# EAGLE design node (EAGLE 7.2.0)
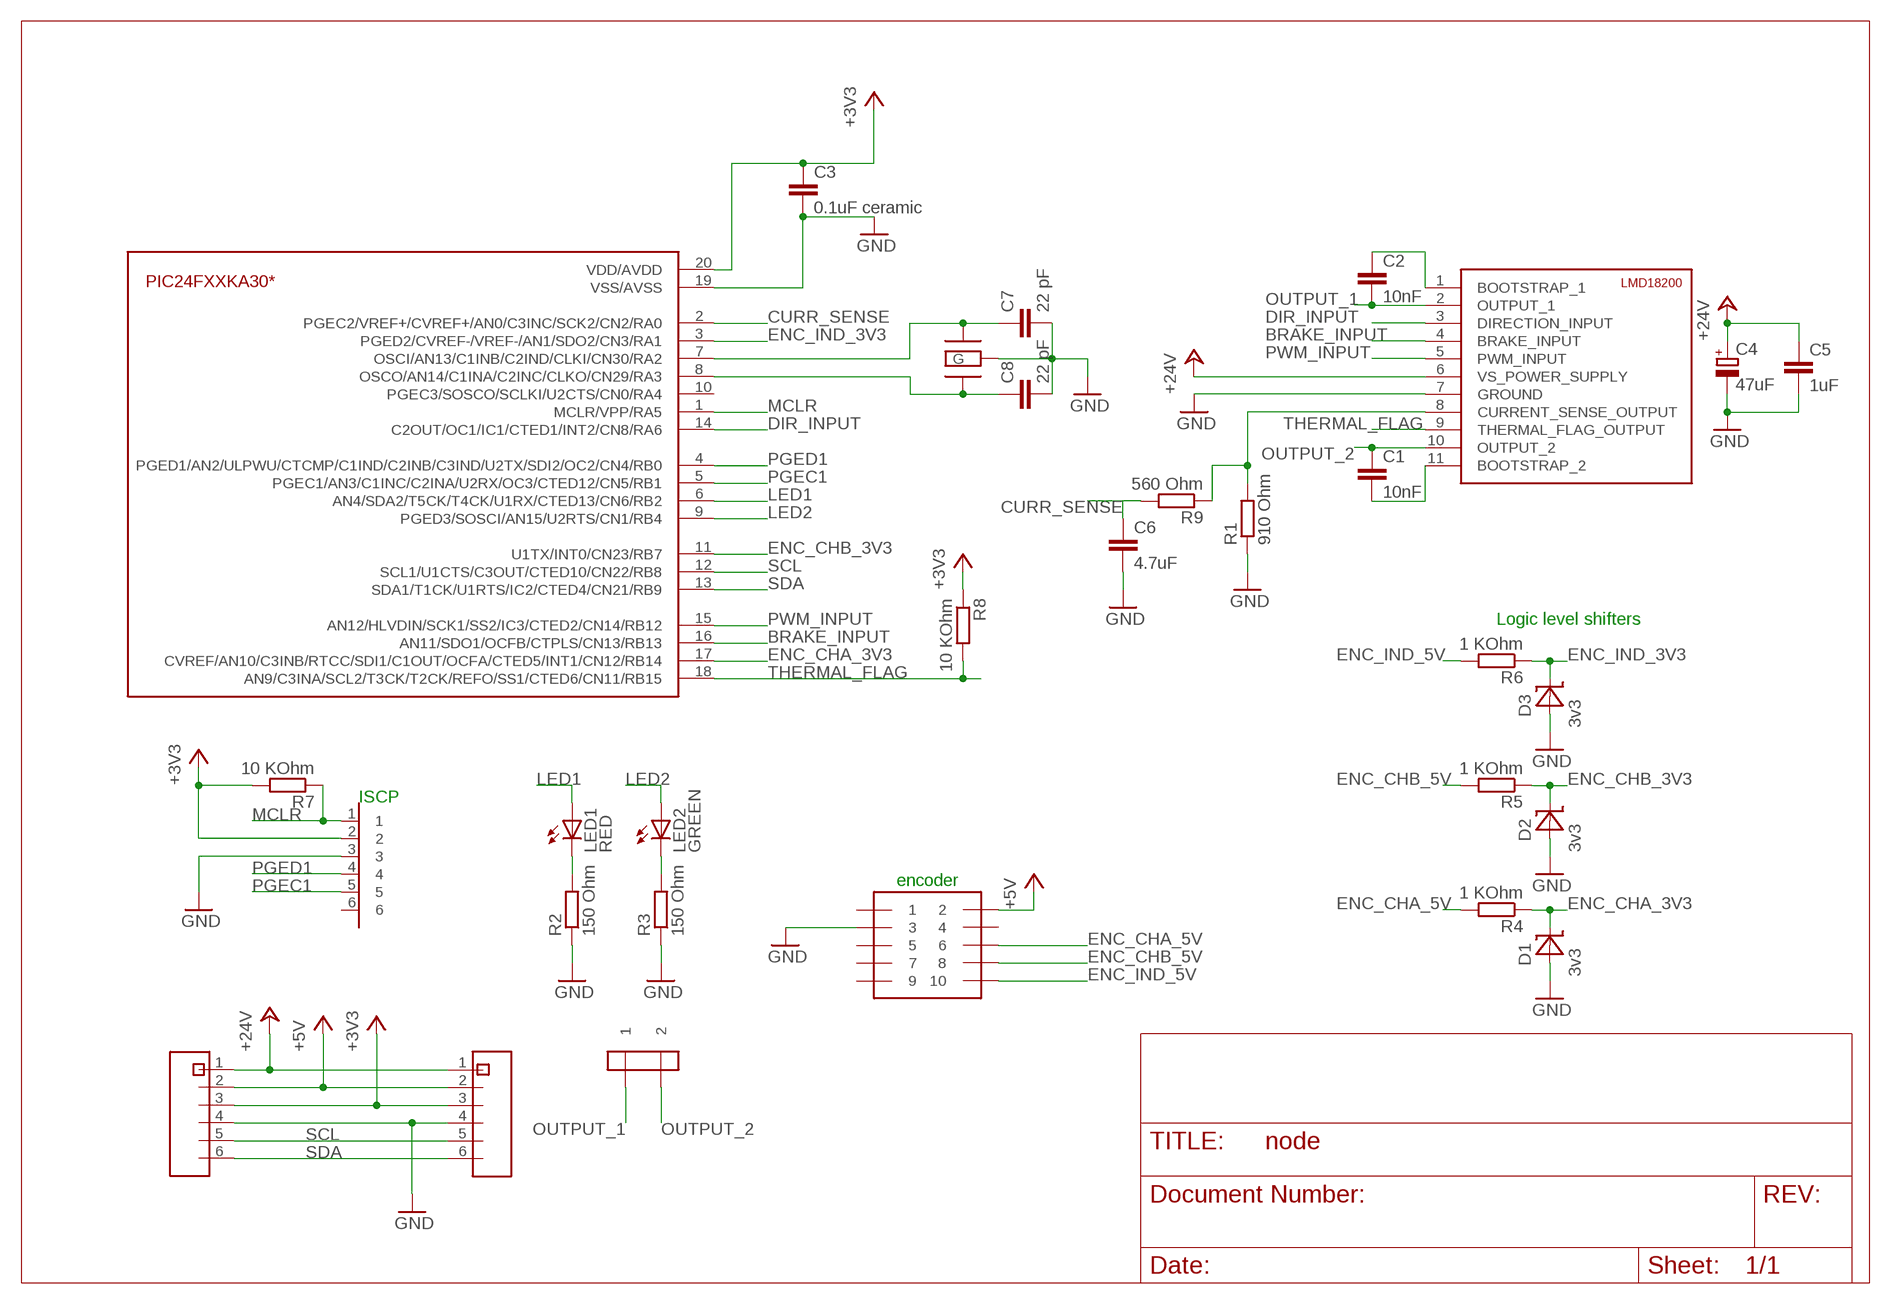
[diagram p0: schematic, sheet 1]

## Parts
C1  10nF  C-EUC0603  [C0603]
C2  10nF  C-EUC0603  [C0603]
C3  0.1uF ceramic  C-EUC0805K  [C0805K]
C4  47uF  CPOL-EUE5-10.5  [E5-10,5]
C5  1uF  C-EU050-025X075  [C050-025X075]
C6  4.7uF  C-EUC0805K  [C0805K]
C7  22 pF  C-EUC0603  [C0603]
C8  22 pF  C-EUC0603  [C0603]
D1  3v3  ZENER_SOD323  [SOD-323]
D2  3v3  ZENER_SOD323  [SOD-323]
D3  3v3  ZENER_SOD323  [SOD-323]
LED1  RED  LEDCHIPLED_1206  [CHIPLED_1206]
LED2  GREEN  LEDCHIPLED_1206  [CHIPLED_1206]
R1  910 Ohm  R-EU_R0603  [R0603]
R2  150 Ohm  R-EU_R0603  [R0603]
R3  150 Ohm  R-EU_R0603  [R0603]
R4  1 KOhm  R-EU_R0603  [R0603]
R5  1 KOhm  R-EU_R0603  [R0603]
R6  1 KOhm  R-EU_R0603  [R0603]
R7  10 KOhm  R-EU_R0603  [R0603]
R8  10 KOhm  R-EU_R0603  [R0603]
R9  560 Ohm  R-EU_R0603  [R0603]
U$1  PIC24F32KA301  [SSOP-20]
U$2  LMD18200  [TO-220-11]
U$3  MOLEX_3.96MM_6P  [MOLEX_3.96MM_6P]
U$4  MOLEX_3.96MM_6P  [MOLEX_3.96MM_6P]
U$5  DIN41651_10P  [DIN41651_10P]
U$6  STIFTLIST_6X1P  [STIFTLIST_6X1P]
U$7  CRYSTAL_ELFA  [CRYSTAL_SMD]
U$8  PCB_SKRUVPLINT_2P  [PCB_SKRUVPLINT_2P]

## Nets
+3V3: C3.1 R7.2 R8.1 U$1.20(VDD/AVDD) U$3.3 U$4.3 U$6.2
+5V: U$3.2 U$4.2 U$5.2
+24V: C4.+ C5.1 U$2.6(VS_POWER_SUPPLY) U$3.1 U$4.1
BRAKE_INPUT: U$1.16(AN11/SDO1/OCFB/CTPLS/CN13/RB13) U$2.4(BRAKE_INPUT)
CURR_SENSE: C6.1 R9.2 U$1.2(PGEC2/VREF+/CVREF+/AN0/C3INC/SCK2/CN2/RA0)
CURR_SENSE_OUTPUT: R1.2 R9.1 U$2.8(CURRENT_SENSE_OUTPUT)
DIR_INPUT: U$1.14(C2OUT/OC1/IC1/CTED1/INT2/CN8/RA6) U$2.3(DIRECTION_INPUT)
ENC_CHA_3V3: D1.C R4.1 U$1.17(CVREF/AN10/C3INB/RTCC/SDI1/C1OUT/OCFA/CTED5/INT1/CN12/RB14)
ENC_CHA_5V: R4.2 U$5.6
ENC_CHB_3V3: D2.C R5.1 U$1.11(U1TX/INT0/CN23/RB7)
ENC_CHB_5V: R5.2 U$5.8
ENC_IND_3V3: D3.C R6.1 U$1.3(PGED2/CVREF-/VREF-/AN1/SDO2/CN3/RA1)
ENC_IND_5V: R6.2 U$5.10
GND: C3.2 C4.- C5.2 C6.2 C7.2 C8.2 D1.A D2.A D3.A R1.1 R2.1 R3.1 U$1.19(VSS/AVSS) U$2.7(GROUND) U$3.4 U$4.4 U$5.3 U$6.3 U$7.2(G) U$7.4(G)
LED1: LED1.A U$1.6(AN4/SDA2/T5CK/T4CK/U1RX/CTED13/CN6/RB2)
LED2: LED2.A U$1.9(PGED3/SOSCI/AN15/U2RTS/CN1/RB4)
MCLR: R7.1 U$1.1(MCLR/VPP/RA5) U$6.1
N$1: C1.2 U$2.11(BOOTSTRAP_2)
N$2: LED1.C R2.2
N$3: LED2.C R3.2
N$4: C2.1 U$2.1(BOOTSTRAP_1)
N$5: C7.1 U$1.7(OSCI/AN13/C1INB/C2IND/CLKI/CN30/RA2) U$7.3(CRYSTAL_2)
N$6: C8.1 U$1.8(OSCO/AN14/C1INA/C2INC/CLKO/CN29/RA3) U$7.1(CRYSTAL_1)
OUTPUT_1: C2.2 U$2.2(OUTPUT_1) U$8.1
OUTPUT_2: C1.1 U$2.10(OUTPUT_2) U$8.2
PGEC1: U$1.5(PGEC1/AN3/C1INC/C2INA/U2RX/OC3/CTED12/CN5/RB1) U$6.5
PGED1: U$1.4(PGED1/AN2/ULPWU/CTCMP/C1IND/C2INB/C3IND/U2TX/SDI2/OC2/CN4/RB0) U$6.4
PWM_INPUT: U$1.15(AN12/HLVDIN/SCK1/SS2/IC3/CTED2/CN14/RB12) U$2.5(PWM_INPUT)
SCL: U$1.12(SCL1/U1CTS/C3OUT/CTED10/CN22/RB8) U$3.5 U$4.5
SDA: U$1.13(SDA1/T1CK/U1RTS/IC2/CTED4/CN21/RB9) U$3.6 U$4.6
THERMAL_FLAG: R8.2 U$1.18(AN9/C3INA/SCL2/T3CK/T2CK/REFO/SS1/CTED6/CN11/RB15) U$2.9(THERMAL_FLAG_OUTPUT)
Unconnected: U$1.10(PGEC3/SOSCO/SCLKI/U2CTS/CN0/RA4) U$5.1 U$5.4 U$5.5 U$5.7 U$5.9 U$6.6

## Notes on the sheet
- Logic level shifters
- ISCP
- encoder

## Library data of the parts
C1-C3 C6 = resistor:C-EU: CAPACITOR, European symbol
C4 = rcl:CPOL-EU: POLARIZED CAPACITOR, European symbol
C5 C7 C8 = rcl:C-EU: CAPACITOR, European symbol
D1-D3 = mylib:ZENER_SOD323: A Zener Diode with SOD323 package
LED1 LED2 = led:LED: LED OSRAM: - CHIPLED LG R971, LG N971, LY N971, LG Q971, LY Q971, LO R971, LY R971 LH N974, LH R974 LS Q976, LO Q976, LY Q976 LO Q996 - Hyper CHIPLED LW Q18S LB Q993, LB Q99A, LB R99A - SideLED LS A670, LO A670, LY A670, LG A670, LP A670 LB A673, LV A673, LT A673, LW A673 LH A674 LY A675 LS A676, LA A676, LO A676, LY A676, LW A676 LS A679, LY A679, LG A679 - Hyper Micro SIDELED® LS Y876, LA Y876, LO Y876, LY Y876 LT Y87S - SmartLED LW L88C, LW L88S LB L89C, LB L89S, LG L890 LS L89K, LO L89K, LY L89K LS L896, LA L896, LO L896, LY L896 - TOPLED LS T670, LO T670, LY T670, LG T670, LP T670 LSG T670, LSP T670, LSY T670, LOP T670, LYG T670 LG T671, LOG T671, LSG T671 LB T673, LV T673, LT T673, LW T673 LH T674 LS T676, LA T676, LO T676, LY T676, LB T676, LH T676, LSB T676, LW T676 LB T67C, LV T67C, LT T67C, LS T67K, LO T67K, LY T67K, LW E67C LS E67B, LA E67B, LO E67B, LY E67B, LB E67C, LV E67C, LT E67C LW T67C LS T679, LY T679, LG T679 LS T770, LO T770, LY T770, LG T770, LP T770 LB T773, LV T773, LT T773, LW T773 LH T774 LS E675, LA E675, LY E675, LS T675 LS T776, LA T776, LO T776, LY T776, LB T776 LHGB T686 LT T68C, LB T68C - Hyper Mini TOPLED® LB M676 - Mini TOPLED Santana® LG M470 LS M47K, LO M47K, LY M47K Source: http://www.osram.convergy.de LUXEON: - LUMILED® LXK2-PW12-R00, LXK2-PW12-S00, LXK2-PW14-U00, LXK2-PW14-V00 LXK2-PM12-R00, LXK2-PM12-S00, LXK2-PM14-U00 LXK2-PE12-Q00, LXK2-PE12-R00, LXK2-PE12-S00, LXK2-PE14-T00, LXK2-PE14-U00 LXK2-PB12-K00, LXK2-PB12-L00, LXK2-PB12-M00, LXK2-PB14-N00, LXK2-PB14-P00, LXK2-PB14-Q00 LXK2-PR12-L00, LXK2-PR12-M00, LXK2-PR14-Q00, LXK2-PR14-R00 LXK2-PD12-Q00, LXK2-PD12-R00, LXK2-PD12-S00 LXK2-PH12-R00, LXK2-PH12-S00 LXK2-PL12-P00, LXK2-PL12-Q00, LXK2-PL12-R00 Source: www.luxeon.com KINGBRIGHT: KA-3528ASYC Source: www.kingbright.com
R1-R9 = resistor:R-EU_: RESISTOR, European symbol
U$1 = mylib:PIC24F32KA301: PIC32F32KA30* available at https://www.elfa.se/elfa3~se_sv/elfa/init.do?item=73-349-31&toc=20970
U$2 = mylib:LMD18200: LMD18200 motor control chip with current sense 3A
U$3 U$4 = mylib:MOLEX_3.96MM_6P: A 6 pin molex connector with raster 3.96mm
U$5 = mylib:DIN41651_10P: DIN 41651 10P contact https://www.elfa.se/elfa3~se_sv/elfa/init.do?item=43-653-93&toc=0&q=DIN+41651+10P
U$6 = mylib:STIFTLIST_6X1P
U$7 = mylib:CRYSTAL_ELFA: Crystal: https://www.elfa.se/elfa3~se_sv/elfa/init.do?item=74-519-88&toc=20166
U$8 = mylib:PCB_SKRUVPLINT_2P

## Board
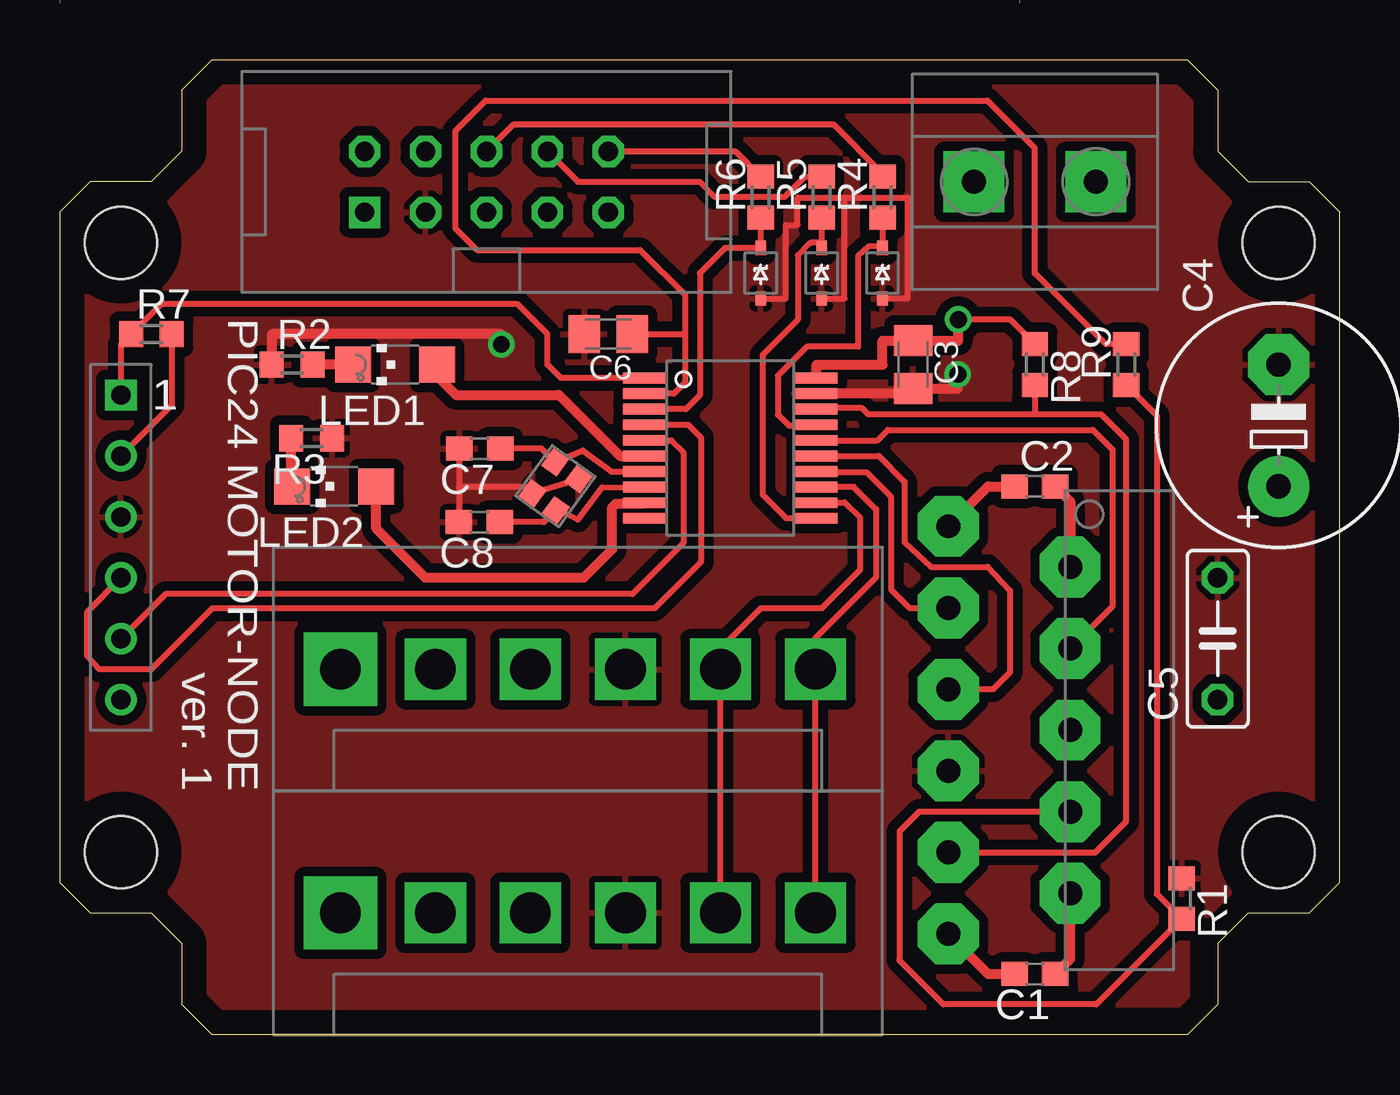
[diagram p1: board, top side]
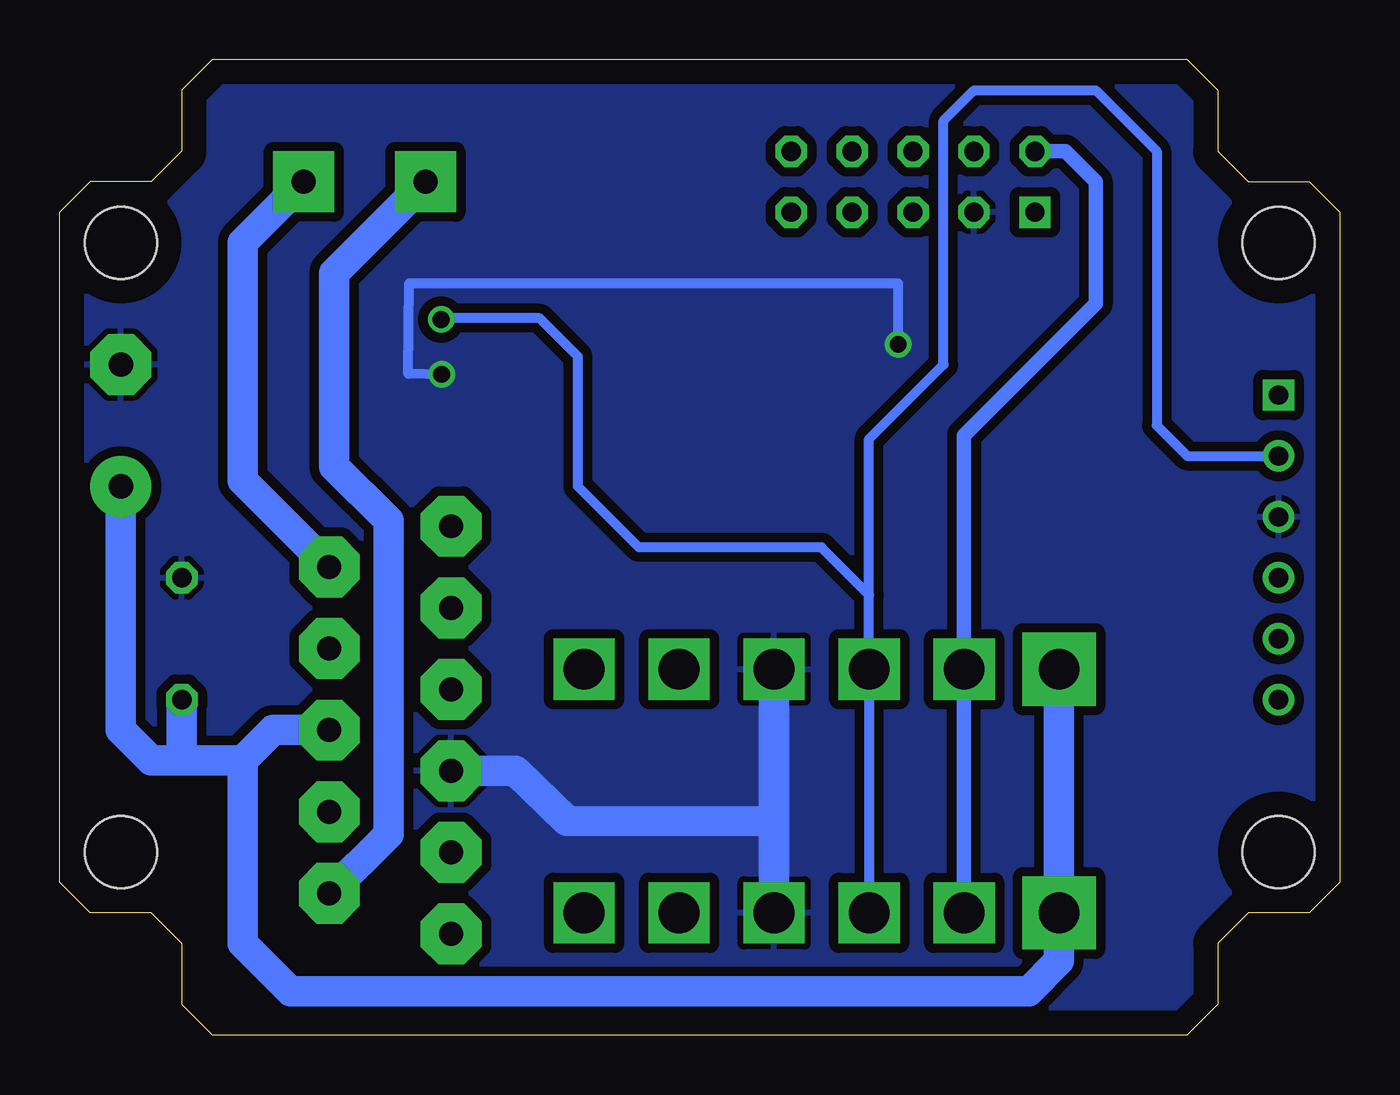
[diagram p2: board, bottom side, seen from below]

Size 53.34 x 40.64 mm. Coordinates in mm from the lower left corner, seen from the top.
Outline: 48.26,36.83 49.53,35.56 52.07,35.56 53.34,34.29 53.34,6.35 52.07,5.08 49.53,5.08 48.26,3.81 48.26,1.27 46.99,0 6.35,0 5.08,1.27 5.08,3.81 3.81,5.08 1.27,5.08 0,6.35 0,34.29 1.27,35.56 3.81,35.56 5.08,36.83 5.08,39.37 6.35,40.64 46.99,40.64 48.26,39.37 48.26,36.83
Copper layers (1*16): Top 0.035mm / dielectric 1.5mm / Bottom 0.035mm
Design rules "default *": minimum track width 10mil, minimum drill 24mil, track to track 0.4mm, track to pad 10mil, pad to pad 8mil, via to via 8mil, smd to smd 8mil, copper to edge 40mil, drill to drill 8mil, minimum pad ring 10mil, minimum via ring 8mil, stop-mask expansion 4mil, vias tented up to drill 0mil, thermal gap 10mil
Holes 3 mm at 2.54,33.02 2.54,7.62 50.8,7.62 50.8,33.02

### Footprints (pad centres in the part's own frame; a part is rotated, then mirrored left to right if it is on the bottom)
C0603 = smd 1.1 x 1: 1 -0.85,0; 2 0.85,0
C0805K = smd 1.3 x 1.6: 1 -1,0; 2 1,0
E5-10,5 = drill 1.016 pad 2.54: + -2.54,0 | drill 1.016 pad 2.54 octagon: - 2.54,0
C050-025X075 = drill 0.813 octagon: 1 -2.54,0; 2 2.54,0
SOD-323 = smd 0.59 x 0.45: A 1.055,0; C -1.055,0
CHIPLED_1206 = smd 1.5 x 1.5: A 0,-1.75; C 0,1.75
R0603 = smd 1 x 1.1: 1 -0.85,0; 2 0.85,0
SSOP-20 = smd 1.75 x 0.45: 1 -3.6,3.25; 2 -3.6,2.6; 3 -3.6,1.95; 4 -3.6,1.3; 5 -3.6,0.65; 6 -3.6,0; 7 -3.6,-0.65; 8 -3.6,-1.3; 9 -3.6,-1.95; 10 -3.6,-2.6; 11 3.6,-2.6; 12 3.6,-1.95; 13 3.6,-1.3; 14 3.6,-0.65; 15 3.6,0; 16 3.6,0.65; 17 3.6,1.3; 18 3.6,1.95; 19 3.6,2.6; 20 3.6,3.25
TO-220-11 = drill 1 pad 2.54 octagon: 1 -4.88,8.5; 2 0.2,6.8; 3 -4.88,5.1; 4 0.2,3.4; 5 -4.88,1.7; 6 0.2,0; 7 -4.88,-1.7; 8 0.2,-3.4; 9 -4.88,-5.1; 10 0.2,-6.8; 11 -4.88,-8.5
MOLEX_3.96MM_6P = drill 1.7 pad 3.048 square: 1 0,9.9 | drill 1.7 pad 2.54 square: 2 0,5.94; 3 0,1.98; 4 0,-1.98; 5 0,-5.94; 6 0,-9.9
DIN41651_10P = drill 0.8 square: 1 -1.27,5.08 | drill 0.8 octagon: 2 1.27,5.08; 3 -1.27,2.54; 4 1.27,2.54; 5 -1.27,0; 6 1.27,0; 7 -1.27,-2.54; 8 1.27,-2.54; 9 -1.27,-5.08; 10 1.27,-5.08
STIFTLIST_6X1P = drill 0.8 square: 1 0,7.62 | drill 0.8: 2 0,5.08; 3 0,2.54; 4 0,0; 5 0,-2.54; 6 0,-5.08
CRYSTAL_SMD = smd 0.9 x 0.8: 1 -0.8,-0.6; 2 0.8,-0.6; 3 0.8,0.6; 4 -0.8,0.6
PCB_SKRUVPLINT_2P = drill 1 pad 2.54 square: 1 -2.54,0; 2 2.54,0

### Placement (x,y rotation side)
C1  40.64,2.54 180 top
C2  40.64,22.86 0 top
C3  35.56,27.94 270 top
C4  50.8,25.4 90 top
C5  48.26,16.51 90 top
C6  22.86,29.21 180 top
C7  17.5,24.44 180 top
C8  17.48,21.37 180 top
D1  34.29,31.75 270 top
D2  31.75,31.75 270 top
D3  29.21,31.75 270 top
LED1  13.97,27.94 90 top
LED2  11.43,22.86 90 top
R1  46.76,5.68 270 top
R2  9.68,27.94 0 top
R3  10.49,24.87 180 top
R4  34.29,34.92 90 top
R5  31.75,34.92 90 top
R6  29.21,34.92 90 top
R7  3.81,29.21 0 top
R8  40.64,27.94 270 top
R9  44.45,27.94 90 top
U$1  27.94,24.13 0 top
U$2  41.91,12.7 0 top
U$3  21.59,15.24 90 top
U$4  21.59,5.08 90 top
U$5  17.78,35.56 90 top
U$6  2.54,19.05 0 top
U$7  20.66,22.87 54 top
U$8  40.64,35.56 180 top

### Tracks (layer width: path | path; a pad name or v marks a point on that pad's centre or on a via)
+3V3  (via drill 0.7)
  Top 0.254: R8.1 39.61,29.82 v37.45,29.82 | R7.2 4.66,26.25 U$6.2
  Top 0.406: U$1.20 31.54,27.94 34.29,27.94 34.29,28.94 C3.1 37.45,28.94 v37.45,29.82
  Bottom 0.406: U$4.3 U$3.3 19.61,18.34 | 19.61,18.34 21.59,20.32 29.21,20.32 31.75,22.86 31.75,28.28 33.34,29.87 37.4,29.87 v37.45,29.82 | 19.61,18.34 19.61,24.84 16.51,27.94 16.51,38.1 15.24,39.37 10.16,39.37 7.62,36.83 7.62,25.4 6.35,24.13 U$6.2
+5V
  Bottom 0.61: U$4.2 U$3.2 15.65,24.99 10.16,30.48 10.16,35.56 11.43,36.83 U$5.2
+24V
  Bottom 1.27: 45.72,11.43 45.72,3.81 43.73,1.82 12.96,1.82 11.69,3.09 U$4.1 U$3.1 | 45.72,11.43 44.45,12.7 U$2.6 | C4.+ 50.8,12.7 49.53,11.43 48.26,11.43 | 45.72,11.43 48.26,11.43 | C5.1 48.26,11.43
BRAKE_INPUT
  Top 0.254: U$1.16 34.07,24.78 34.51,25.22 43.05,25.22 43.87,24.4 43.87,17.86 U$2.4
CURR_SENSE
  Top 0.254: 26.05,29.21 26.05,30.85 24.18,32.72 17.38,32.72 16.48,33.62 16.48,37.68 17.75,38.95 38.66,38.95 40.64,36.97 40.64,31.75 43.6,28.79 R9.2 | 26.05,29.21 26.05,27.19 25.59,26.73 U$1.2 | C6.1 26.05,29.21
CURR_SENSE_OUTPUT
  Top 0.254: U$2.8 35.81,9.3 35,8.49 35,3.12 34.99,3.11 36.83,1.27 43.2,1.27 R1.2 45.72,5.87 45.72,25.82 R9.1
DIR_INPUT
  Top 0.254: U$1.14 31.54,23.46 33.61,23.46 34.64,22.43 34.64,18.57 35.41,17.8 U$2.3
ENC_CHA_3V3
  Top 0.254: R4.1 D1.C 34.23,32.86 33.71,32.87 33.27,32.48 33.27,28.69 31.14,28.69 29.93,27.48 29.93,25.85 30.39,25.39 31.5,25.39 U$1.17
ENC_CHA_5V
  Top 0.254: U$5.6 18.91,37.96 32.24,37.96 34.29,35.91 R4.2
ENC_CHB_3V3
  Top 0.254: R5.1 31.75,33.02 | D2.C 31.75,33.02 | 31.75,33.02 31.29,33.02 30.76,32.49 30.76,29.81 29.29,28.34 29.29,22.52 30.27,21.54 U$1.11
ENC_CHB_5V
  Top 0.254: U$5.8 21.59,35.56 26.67,35.56 27.29,34.94 30.22,34.94 31.05,35.77 R5.2
ENC_IND_3V3
  Top 0.254: R6.1 D3.C 27.73,32.8 26.67,31.75 26.67,26.66 26.09,26.08 U$1.3
ENC_IND_5V
  Top 0.254: U$5.10 28.16,36.83 R6.2
GND  (via drill 0.7)
  Top 0.254: U$7.2 U$7.4 19.73,22.84 16.63,22.84 | 16.63,22.84 C8.2 | C7.2 16.63,24.42 16.63,22.84 | D2.A 32.71,30.7 32.71,34.9 | 32.71,34.9 35.33,34.9 35.33,30.7 D1.A | D3.A 30.26,30.7 30.26,33.76 30.75,33.76 30.75,34.9 32.71,34.9
  Top 0.406: U$1.19 35.56,26.73 C3.2 37.43,26.94 v37.43,27.53 | v18.4,28.78 18.4,29.21 8.83,29.21 R2.1
  Bottom 0.406: v37.43,27.53 38.82,27.56 38.78,31.33 18.4,31.33 v18.4,28.78
  Bottom 1.27: U$3.4 U$4.4 | 37.05,11.01 34.34,11.01 32.21,8.91 23.59,8.9
  pour Top: 0,6.35 0,34.29 1.27,35.56 3.81,35.56 5.08,36.83 5.08,39.37 6.35,40.64 46.99,40.64 48.26,39.37 48.26,36.83 49.53,35.56 52.07,35.56 53.34,34.29 53.34,6.35 52.07,5.08 49.53,5.08 48.26,3.81 48.26,1.27 46.99,0 6.35,0 5.08,1.27 5.08,3.81 3.81,5.08 1.27,5.08
  pour Bottom: 0,6.35 0,34.29 1.27,35.56 3.81,35.56 5.08,36.83 5.08,39.37 6.35,40.64 46.99,40.64 48.26,39.37 48.26,36.83 49.53,35.56 52.07,35.56 53.34,34.29 53.34,6.35 52.07,5.08 49.53,5.08 48.26,3.81 48.26,1.27 46.99,0 6.35,0 5.08,1.27 5.08,3.81 3.81,5.08 1.27,5.08
LED1
  Top 0.406: U$1.6 23.34,24.13 20.8,26.67 16.51,26.67 15.72,27.46 LED1.A
LED2
  Top 0.406: U$1.9 24.3,22.14 23.17,22.14 23.02,21.99 23.02,20.24 21.83,19.05 15.24,19.05 13.18,21.11 LED2.A
MCLR
  Top 0.254: U$1.1 20.88,27.38 20.32,27.94 20.32,29.21 19.05,30.48 4.23,30.48 R7.1 2.54,28.79 U$6.1
N$1
  Top 0.406: U$2.11 38.69,2.54 C1.2
N$2
  Top 0.406: LED1.C R2.2
N$3
  Top 0.406: LED2.C 9.64,22.9 R3.2
N$4
  Top 0.406: U$2.1 38.69,22.86 C2.1
N$5
  Top 0.254: U$1.7 22.99,23.48 21.79,24.36 U$7.3 20.07,24.44 C7.1
N$6
  Top 0.254: U$1.8 22.6,22.82 21.59,21.48 20.97,21.79 U$7.1 20.17,21.37 C8.1
N$7
  pour Top: 6.35,39.37 6.35,1.27 46.99,1.27 46.99,39.37
OUTPUT_1
  Top 0.406: C2.2 42.11,22.24 U$2.2
  Bottom 1.27: U$2.2 45.72,23.11 45.72,33.02 U$8.1
OUTPUT_2
  Top 0.406: C1.1 42.11,3.16 U$2.10
  Bottom 1.27: U$2.10 39.65,8.36 39.65,21.44 41.91,23.7 41.91,31.75 U$8.2
PGEC1
  Top 0.254: U$1.5 25.48,24.78 25.99,24.27 25.99,20.5 23.86,18.37 4.4,18.37 U$6.5
PGED1
  Top 0.254: U$1.4 26.19,25.43 26.72,24.9 26.72,19.71 24.79,17.78 6.35,17.78 3.81,15.24 1.64,15.24 1.14,15.78 1.14,17.63 U$6.4
PWM_INPUT
  Top 0.254: U$1.15 34.13,24.13 35.21,23.05 35.21,20.53 36.3,19.51 38.68,19.51 39.6,18.52 39.6,15.11 38.89,14.4 U$2.5
SCL
  Top 0.254: U$4.5 U$3.5 27.53,16.1 29.21,17.78 31.75,17.78 33.35,19.38 33.35,21.56 32.71,22.2 31.56,22.2 U$1.12
SDA
  Top 0.254: U$4.6 U$3.6 31.49,16.54 34.02,19.07 34.02,21.9 33.08,22.84 U$1.13
THERMAL_FLAG
  Top 0.254: 31.54,26.1 U$1.18 31.58,26.12 33.44,26.12 33.7,25.86 40.64,25.86 | U$2.9 43.16,7.6 44.45,8.89 44.45,24.82 43.41,25.86 40.64,25.86 | R8.2 40.64,25.86

### Text on the board
tPlace: 1 | PIC24 MOTOR-NODE / ver. 1